# EAGLE design enlampen (EAGLE 5.09)
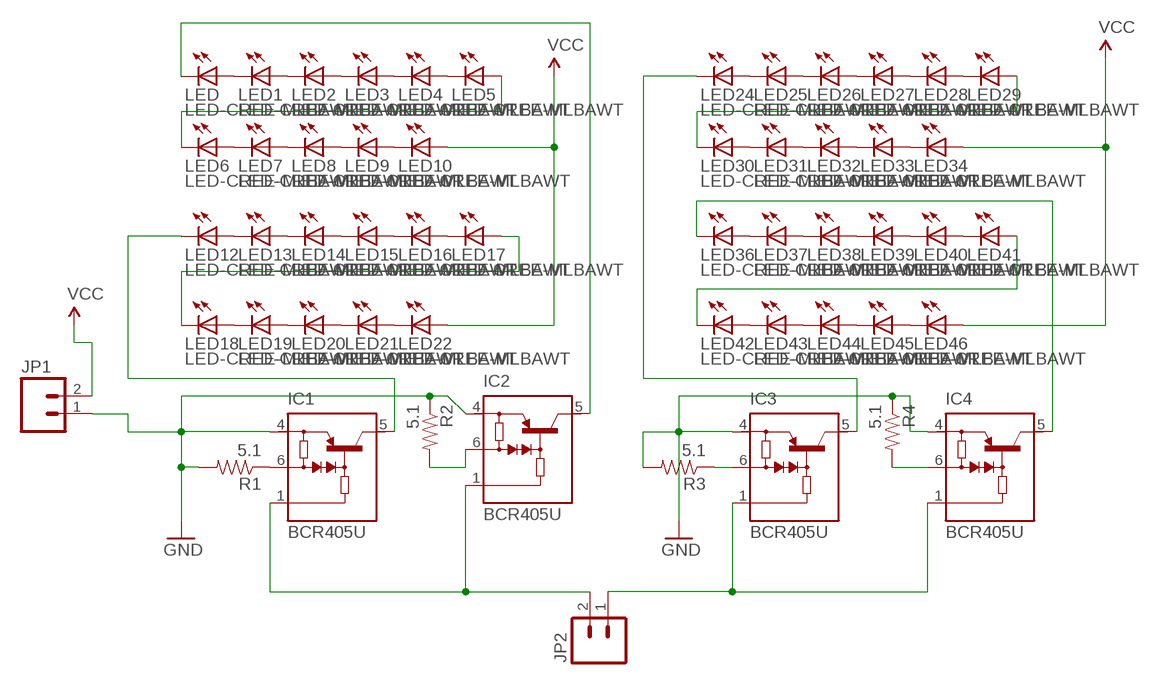
[diagram p0: schematic, sheet 1]

## Parts
IC1  BCR405U  [SC74_INFINEON]
IC2  BCR405U  [SC74_INFINEON]
IC3  BCR405U  [SC74_INFINEON]
IC4  BCR405U  [SC74_INFINEON]
JP1  M02POLAR  [MOLEX-1X2]
JP2  M02POLAR  [MOLEX-1X2]
LED  LED-CREE-MLBAWT  [LED-CREE-MLBAWT]
LED1  LED-CREE-MLBAWT  [LED-CREE-MLBAWT]
LED2  LED-CREE-MLBAWT  [LED-CREE-MLBAWT]
LED3  LED-CREE-MLBAWT  [LED-CREE-MLBAWT]
LED4  LED-CREE-MLBAWT  [LED-CREE-MLBAWT]
LED5  LED-CREE-MLBAWT  [LED-CREE-MLBAWT]
LED6  LED-CREE-MLBAWT  [LED-CREE-MLBAWT]
LED7  LED-CREE-MLBAWT  [LED-CREE-MLBAWT]
LED8  LED-CREE-MLBAWT  [LED-CREE-MLBAWT]
LED9  LED-CREE-MLBAWT  [LED-CREE-MLBAWT]
LED10  LED-CREE-MLBAWT  [LED-CREE-MLBAWT]
LED12  LED-CREE-MLBAWT  [LED-CREE-MLBAWT]
LED13  LED-CREE-MLBAWT  [LED-CREE-MLBAWT]
LED14  LED-CREE-MLBAWT  [LED-CREE-MLBAWT]
LED15  LED-CREE-MLBAWT  [LED-CREE-MLBAWT]
LED16  LED-CREE-MLBAWT  [LED-CREE-MLBAWT]
LED17  LED-CREE-MLBAWT  [LED-CREE-MLBAWT]
LED18  LED-CREE-MLBAWT  [LED-CREE-MLBAWT]
LED19  LED-CREE-MLBAWT  [LED-CREE-MLBAWT]
LED20  LED-CREE-MLBAWT  [LED-CREE-MLBAWT]
LED21  LED-CREE-MLBAWT  [LED-CREE-MLBAWT]
LED22  LED-CREE-MLBAWT  [LED-CREE-MLBAWT]
LED24  LED-CREE-MLBAWT  [LED-CREE-MLBAWT]
LED25  LED-CREE-MLBAWT  [LED-CREE-MLBAWT]
LED26  LED-CREE-MLBAWT  [LED-CREE-MLBAWT]
LED27  LED-CREE-MLBAWT  [LED-CREE-MLBAWT]
LED28  LED-CREE-MLBAWT  [LED-CREE-MLBAWT]
LED29  LED-CREE-MLBAWT  [LED-CREE-MLBAWT]
LED30  LED-CREE-MLBAWT  [LED-CREE-MLBAWT]
LED31  LED-CREE-MLBAWT  [LED-CREE-MLBAWT]
LED32  LED-CREE-MLBAWT  [LED-CREE-MLBAWT]
LED33  LED-CREE-MLBAWT  [LED-CREE-MLBAWT]
LED34  LED-CREE-MLBAWT  [LED-CREE-MLBAWT]
LED36  LED-CREE-MLBAWT  [LED-CREE-MLBAWT]
LED37  LED-CREE-MLBAWT  [LED-CREE-MLBAWT]
LED38  LED-CREE-MLBAWT  [LED-CREE-MLBAWT]
LED39  LED-CREE-MLBAWT  [LED-CREE-MLBAWT]
LED40  LED-CREE-MLBAWT  [LED-CREE-MLBAWT]
LED41  LED-CREE-MLBAWT  [LED-CREE-MLBAWT]
LED42  LED-CREE-MLBAWT  [LED-CREE-MLBAWT]
LED43  LED-CREE-MLBAWT  [LED-CREE-MLBAWT]
LED44  LED-CREE-MLBAWT  [LED-CREE-MLBAWT]
LED45  LED-CREE-MLBAWT  [LED-CREE-MLBAWT]
LED46  LED-CREE-MLBAWT  [LED-CREE-MLBAWT]
R1  5.1  RESISTOR1206  [1206]
R2  5.1  RESISTOR1206  [1206]
R3  5.1  RESISTOR1206  [1206]
R4  5.1  RESISTOR1206  [1206]

## Nets
GND: IC1.4(VS) IC2.4(VS) IC3.4(VS) IC4.4(VS) JP1.1 R1.2 R2.1 R3.2 R4.1
N$1: LED13.ANODE LED14.CATHOD(CATHODE)
N$2: LED1.CATHOD(CATHODE) LED.ANODE
N$3: LED1.ANODE LED2.CATHOD(CATHODE)
N$4: LED2.ANODE LED3.CATHOD(CATHODE)
N$5: LED3.ANODE LED4.CATHOD(CATHODE)
N$6: LED4.ANODE LED5.CATHOD(CATHODE)
N$7: LED12.ANODE LED13.CATHOD(CATHODE)
N$8: LED7.ANODE LED8.CATHOD(CATHODE)
N$9: LED8.ANODE LED9.CATHOD(CATHODE)
N$10: LED9.ANODE LED10.CATHOD(CATHODE)
N$11: IC1.6(REXT) R1.1
N$12: LED20.ANODE LED21.CATHOD(CATHODE)
N$13: LED21.ANODE LED22.CATHOD(CATHODE)
N$14: LED14.ANODE LED15.CATHOD(CATHODE)
N$15: LED15.ANODE LED16.CATHOD(CATHODE)
N$16: LED16.ANODE LED17.CATHOD(CATHODE)
N$17: LED5.ANODE LED6.CATHOD(CATHODE)
N$18: LED18.ANODE LED19.CATHOD(CATHODE)
N$19: LED19.ANODE LED20.CATHOD(CATHODE)
N$20: LED6.ANODE LED7.CATHOD(CATHODE)
N$21: IC2.6(REXT) R2.2
N$22: IC3.6(REXT) R3.1
N$23: LED17.ANODE LED18.CATHOD(CATHODE)
N$25: LED24.ANODE LED25.CATHOD(CATHODE)
N$26: LED25.ANODE LED26.CATHOD(CATHODE)
N$27: LED26.ANODE LED27.CATHOD(CATHODE)
N$28: LED27.ANODE LED28.CATHOD(CATHODE)
N$29: LED28.ANODE LED29.CATHOD(CATHODE)
N$30: LED30.ANODE LED31.CATHOD(CATHODE)
N$31: LED31.ANODE LED32.CATHOD(CATHODE)
N$32: LED32.ANODE LED33.CATHOD(CATHODE)
N$33: LED33.ANODE LED34.CATHOD(CATHODE)
N$34: IC4.6(REXT) R4.2
N$35: LED36.ANODE LED37.CATHOD(CATHODE)
N$36: LED37.ANODE LED38.CATHOD(CATHODE)
N$37: LED38.ANODE LED39.CATHOD(CATHODE)
N$38: LED39.ANODE LED40.CATHOD(CATHODE)
N$39: LED40.ANODE LED41.CATHOD(CATHODE)
N$40: LED42.ANODE LED43.CATHOD(CATHODE)
N$41: LED43.ANODE LED44.CATHOD(CATHODE)
N$42: LED44.ANODE LED45.CATHOD(CATHODE)
N$43: LED45.ANODE LED46.CATHOD(CATHODE)
N$44: IC1.1(GND) IC2.1(GND) JP2.2
N$45: LED29.ANODE LED30.CATHOD(CATHODE)
N$46: IC3.1(GND) IC4.1(GND) JP2.1
N$47: LED41.ANODE LED42.CATHOD(CATHODE)
N$48: IC2.5(IOUT) LED.CATHOD(CATHODE)
N$49: IC1.5(IOUT) LED12.CATHOD(CATHODE)
N$50: IC3.5(IOUT) LED24.CATHOD(CATHODE)
N$51: IC4.5(IOUT) LED36.CATHOD(CATHODE)
VCC: JP1.2 LED10.ANODE LED22.ANODE LED34.ANODE LED46.ANODE

## Library data of the parts
IC1-IC4 = digital-transistors-1:BCR405: Current Source 40V, typ. 50mA, max 65mA
JP1 JP2 = SparkFun:M02: Header 2 Standard 2-pin 0.1" header. Use with straight break away headers (SKU : PRT-00116), right angle break away headers (PRT-00553), swiss pins (PRT-00743), machine pins (PRT-00117), and female headers (PRT-00115). Molex polarized connector foot print use with SKU : PRT-08233 with associated crimp pins and housings.
LED LED1-LED10 LED12-LED22 LED24-LED34 LED36-LED46 = MaxHenstell:LED-CREE-MLBAWT
R1-R4 = SparkFun:RESISTOR: Resistor Basic schematic elements and footprints for 0603, 1206, and PTH resistors.

## Board
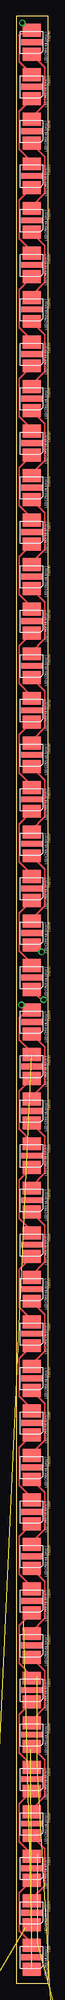
[diagram p1: board, top side]
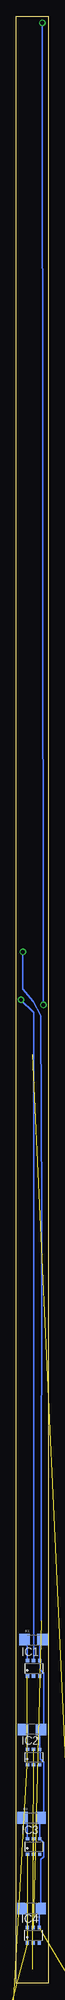
[diagram p2: board, bottom side, seen from below]

Size 5 x 304.8 mm. Coordinates in mm from the lower left corner, seen from the top.
Outline: 0,0 5,0 5,304.8 0,304.8 0,0
Copper layers (1*16): Top 0.035mm / dielectric 1.5mm / Bottom 0.035mm
Design rules "default *": minimum track width 10mil, minimum drill 24mil, track to track 8mil, track to pad 8mil, pad to pad 8mil, via to via 8mil, smd to smd 8mil, copper to edge 8mil, drill to drill 8mil, minimum pad ring 10mil, minimum via ring 8mil, stop-mask expansion 4mil, vias tented up to drill 0mil, thermal gap 10mil

### Footprints (pad centres in the part's own frame; a part is rotated, then mirrored left to right if it is on the bottom)
SC74_INFINEON = smd 0.5 x 0.5: 1 -0.95,-1.2; 2 0,-1.2; 3 0.95,-1.2; 4 0.95,1.2; 5 0,1.2; 6 -0.95,1.2
MOLEX-1X2 = drill 1.016 pad 1.88 square: 1 0,0 | drill 1.016 pad 1.88 round: 2 2.54,0
LED-CREE-MLBAWT = smd 2 x 2.8: ANODE -0.15,-1.75; CATHOD 3.55,-1.75 | smd 0.9 x 3.3: HEAT 1.7,-1.7
1206 = smd 1.6 x 1.8: 1 -1.4,0; 2 1.4,0

### Placement (x,y rotation side)
IC1  2.3,48.8 0 bottom
IC2  2.3,35.05 0 bottom
IC3  2.3,21.2 0 bottom
IC4  2.35,7.45 0 bottom
JP1  -7.1,-5.7 0 top  (outside the outline)
JP2  8.55,-13.45 180 top  (outside the outline)
LED  4.15,5.75 270 top
LED1  4.15,19.55 270 top
LED2  4.15,33.35 270 top
LED3  4.15,47.15 270 top
LED4  4.15,60.95 270 top
LED5  4.15,74.75 270 top
LED6  4.15,88.55 270 top
LED7  4.15,102.35 270 top
LED8  4.15,116.15 270 top
LED9  4.15,129.95 270 top
LED10  4.15,143.75 270 top
LED12  4.15,157.55 270 top
LED13  4.15,171.35 270 top
LED14  4.15,185.15 270 top
LED15  4.15,198.95 270 top
LED16  4.15,212.75 270 top
LED17  4.15,226.55 270 top
LED18  4.15,240.35 270 top
LED19  4.15,254.15 270 top
LED20  4.15,267.95 270 top
LED21  4.15,281.75 270 top
LED22  4.15,295.55 270 top
LED24  4.15,12.65 270 top
LED25  4.15,26.45 270 top
LED26  4.15,40.25 270 top
LED27  4.15,54.05 270 top
LED28  4.15,67.85 270 top
LED29  4.15,81.65 270 top
LED30  4.15,95.45 270 top
LED31  4.15,109.25 270 top
LED32  4.15,123.05 270 top
LED33  4.15,136.85 270 top
LED34  4.15,150.65 270 top
LED36  4.15,164.45 270 top
LED37  4.15,178.25 270 top
LED38  4.15,192.05 270 top
LED39  4.15,205.85 270 top
LED40  4.15,219.65 270 top
LED41  4.15,233.45 270 top
LED42  4.15,247.25 270 top
LED43  4.15,261.05 270 top
LED44  4.15,274.85 270 top
LED45  4.15,288.65 270 top
LED46  4.15,302.45 270 top
R1  2.3,53.25 0 bottom
R2  2.55,39.35 180 bottom
R3  2.6,25.65 0 bottom
R4  2.6,11.6 180 bottom

### Tracks (layer width: path | path; a pad name or v marks a point on that pad's centre or on a via)
GND  (1 unrouted)
  Bottom 0.254: R1.2 1.35,52.8 IC1.4 1.3,49.9 1.3,48.55 0.75,48 0.75,39.8 1.1,39.45 R2.1 1.35,39.15 IC2.4 1.3,36.15 1.3,34.8 0.75,34.25 0.75,26.15 1.15,25.75 R3.2 1.35,25.5 IC3.4 1.3,22.3 0.75,21.75 0.75,19.6 1.15,19.2 1.15,11.7 R4.1 1.4,11.4 IC4.4
N$1
  Top 0.254: LED13.ANODE 2.4,171.8 0.45,173.75 0.45,179.65 LED14.CATHOD
N$2
  Top 0.254: LED.ANODE 2.4,6.2 0.45,8.15 0.45,14.05 LED1.CATHOD
N$3
  Top 0.254: LED1.ANODE 2.4,20 0.45,21.95 0.45,27.85 LED2.CATHOD
N$4
  Top 0.254: LED2.ANODE 2.4,33.8 0.45,35.75 0.45,41.65 LED3.CATHOD
N$5
  Top 0.254: LED3.ANODE 2.4,47.6 0.45,49.55 0.45,55.45 LED4.CATHOD
N$6
  Top 0.254: LED4.ANODE 2.4,61.4 0.45,63.35 0.45,69.25 LED5.CATHOD
N$7
  Top 0.254: LED12.ANODE 2.4,158 0.45,159.95 0.45,165.85 LED13.CATHOD
N$8
  Top 0.254: LED7.ANODE 2.4,102.8 0.45,104.75 0.45,110.65 LED8.CATHOD
N$9
  Top 0.254: LED8.ANODE 2.4,116.6 0.45,118.55 0.45,124.45 LED9.CATHOD
N$10
  Top 0.254: LED9.ANODE 2.4,130.4 0.45,132.35 0.45,138.25 LED10.CATHOD
N$11
  Bottom 0.254: IC1.6 3.25,52.8 R1.1
N$12
  Top 0.254: LED20.ANODE 2.4,268.4 0.45,270.35 0.45,276.25 LED21.CATHOD
N$13
  Top 0.254: LED21.ANODE 2.4,282.2 0.45,284.15 0.45,290.05 LED22.CATHOD
N$14
  Top 0.254: LED14.ANODE 2.4,185.6 0.45,187.55 0.45,193.45 LED15.CATHOD
N$15
  Top 0.254: LED15.ANODE 2.4,199.4 0.45,201.35 0.45,207.25 LED16.CATHOD
N$16
  Top 0.254: LED16.ANODE 2.4,213.2 0.45,215.15 0.45,221.05 LED17.CATHOD
N$17
  Top 0.254: LED5.ANODE 2.4,75.2 0.45,77.15 0.45,83.05 LED6.CATHOD
N$18
  Top 0.254: LED18.ANODE 2.4,240.8 0.45,242.75 0.45,248.65 LED19.CATHOD
N$19
  Top 0.254: LED19.ANODE 2.4,254.6 0.45,256.55 0.45,262.45 LED20.CATHOD
N$20
  Top 0.254: LED6.ANODE 2.4,89 0.45,90.95 0.45,96.85 LED7.CATHOD
N$21
  Bottom 0.254: IC2.6 3.25,38.65 R2.2
N$22
  Bottom 0.254: IC3.6 3.25,24.9 R3.1
N$23
  Top 0.254: LED17.ANODE 2.4,227 0.45,228.95 0.45,234.85 LED18.CATHOD
N$25
  Top 0.254: LED24.ANODE 2.4,13.1 4.45,15.15 4.45,20.85 LED25.CATHOD
N$26
  Top 0.254: LED25.ANODE 2.4,26.9 4.45,28.95 4.45,34.65 LED26.CATHOD
N$27
  Top 0.254: LED26.ANODE 2.4,40.7 4.45,42.75 4.45,48.45 LED27.CATHOD
N$28
  Top 0.254: LED27.ANODE 2.4,54.5 4.45,56.55 4.45,62.25 LED28.CATHOD
N$29
  Top 0.254: LED28.ANODE 2.4,68.3 4.45,70.35 4.45,76.05 LED29.CATHOD
N$30
  Top 0.254: LED30.ANODE 2.4,95.9 4.45,97.95 4.45,103.65 LED31.CATHOD
N$31
  Top 0.254: LED31.ANODE 2.4,109.7 4.45,111.75 4.45,117.45 LED32.CATHOD
N$32
  Top 0.254: LED32.ANODE 2.4,123.5 4.45,125.55 4.45,131.25 LED33.CATHOD
N$33
  Top 0.254: LED33.ANODE 2.4,137.3 4.45,139.35 4.45,145.05 LED34.CATHOD
N$34
  Bottom 0.254: IC4.6 3.3,10.9 R4.2
N$35
  Top 0.254: LED36.ANODE 2.4,164.9 4.45,166.95 4.45,172.65 LED37.CATHOD
N$36
  Top 0.254: LED37.ANODE 2.4,178.7 4.45,180.75 4.45,186.45 LED38.CATHOD
N$37
  Top 0.254: LED38.ANODE 2.4,192.5 4.45,194.55 4.45,200.25 LED39.CATHOD
N$38
  Top 0.254: LED39.ANODE 2.4,206.3 4.45,208.35 4.45,214.05 LED40.CATHOD
N$39
  Top 0.254: LED40.ANODE 2.4,220.1 4.45,222.15 4.45,227.85 LED41.CATHOD
N$40
  Top 0.254: LED42.ANODE 2.4,247.7 4.45,249.75 4.45,255.45 LED43.CATHOD
N$41
  Top 0.254: LED43.ANODE 2.4,261.5 4.45,263.55 4.45,269.25 LED44.CATHOD
N$42
  Top 0.254: LED44.ANODE 2.4,275.3 4.45,277.35 4.45,283.05 LED45.CATHOD
N$43
  Top 0.254: LED45.ANODE 2.4,289.1 4.45,291.15 4.45,296.85 LED46.CATHOD
N$44  (2 unrouted)
N$45
  Top 0.254: LED29.ANODE 2.4,82.1 4.45,84.15 4.45,89.85 LED30.CATHOD
N$46  (2 unrouted)
N$47
  Top 0.254: LED41.ANODE 2.4,233.9 4.45,235.95 4.45,241.65 LED42.CATHOD
N$48  (1 unrouted)
N$49  (via drill 0.61)
  Top 0.254: v4.25,152.4 4,152.4 LED12.CATHOD
  Bottom 0.254: IC1.5 2.3,150.45 v4.25,152.4
N$50  (1 unrouted)
N$51  (via drill 0.6)  (1 unrouted)
  Top 0.254: LED36.CATHOD v3.95,159.8
  Bottom 0.254: v3.95,159.8 3.95,154.05 2.35,152.1 1.2,149.95 1,119.75 1.1,62.45 1.1,56.15
VCC  (via drill 0.6)  (1 unrouted)
  Top 0.254: LED22.ANODE 2.4,296 2.2,296 0.45,297.75 0.45,301.75 0.4,301.8 1.7,302.6 | 1.7,302.6 LED46.ANODE | LED10.ANODE 2.4,144.2 0.45,146.15 0.45,149.55 1.7,150.8 LED34.ANODE v0.8,151.6 | 1.7,302.6 v0.95,303.75
  Bottom 0.254: v0.95,303.75 v0.8,151.6